# Altium schematic sheet Inverter-LLC Control.SchDoc
size A3
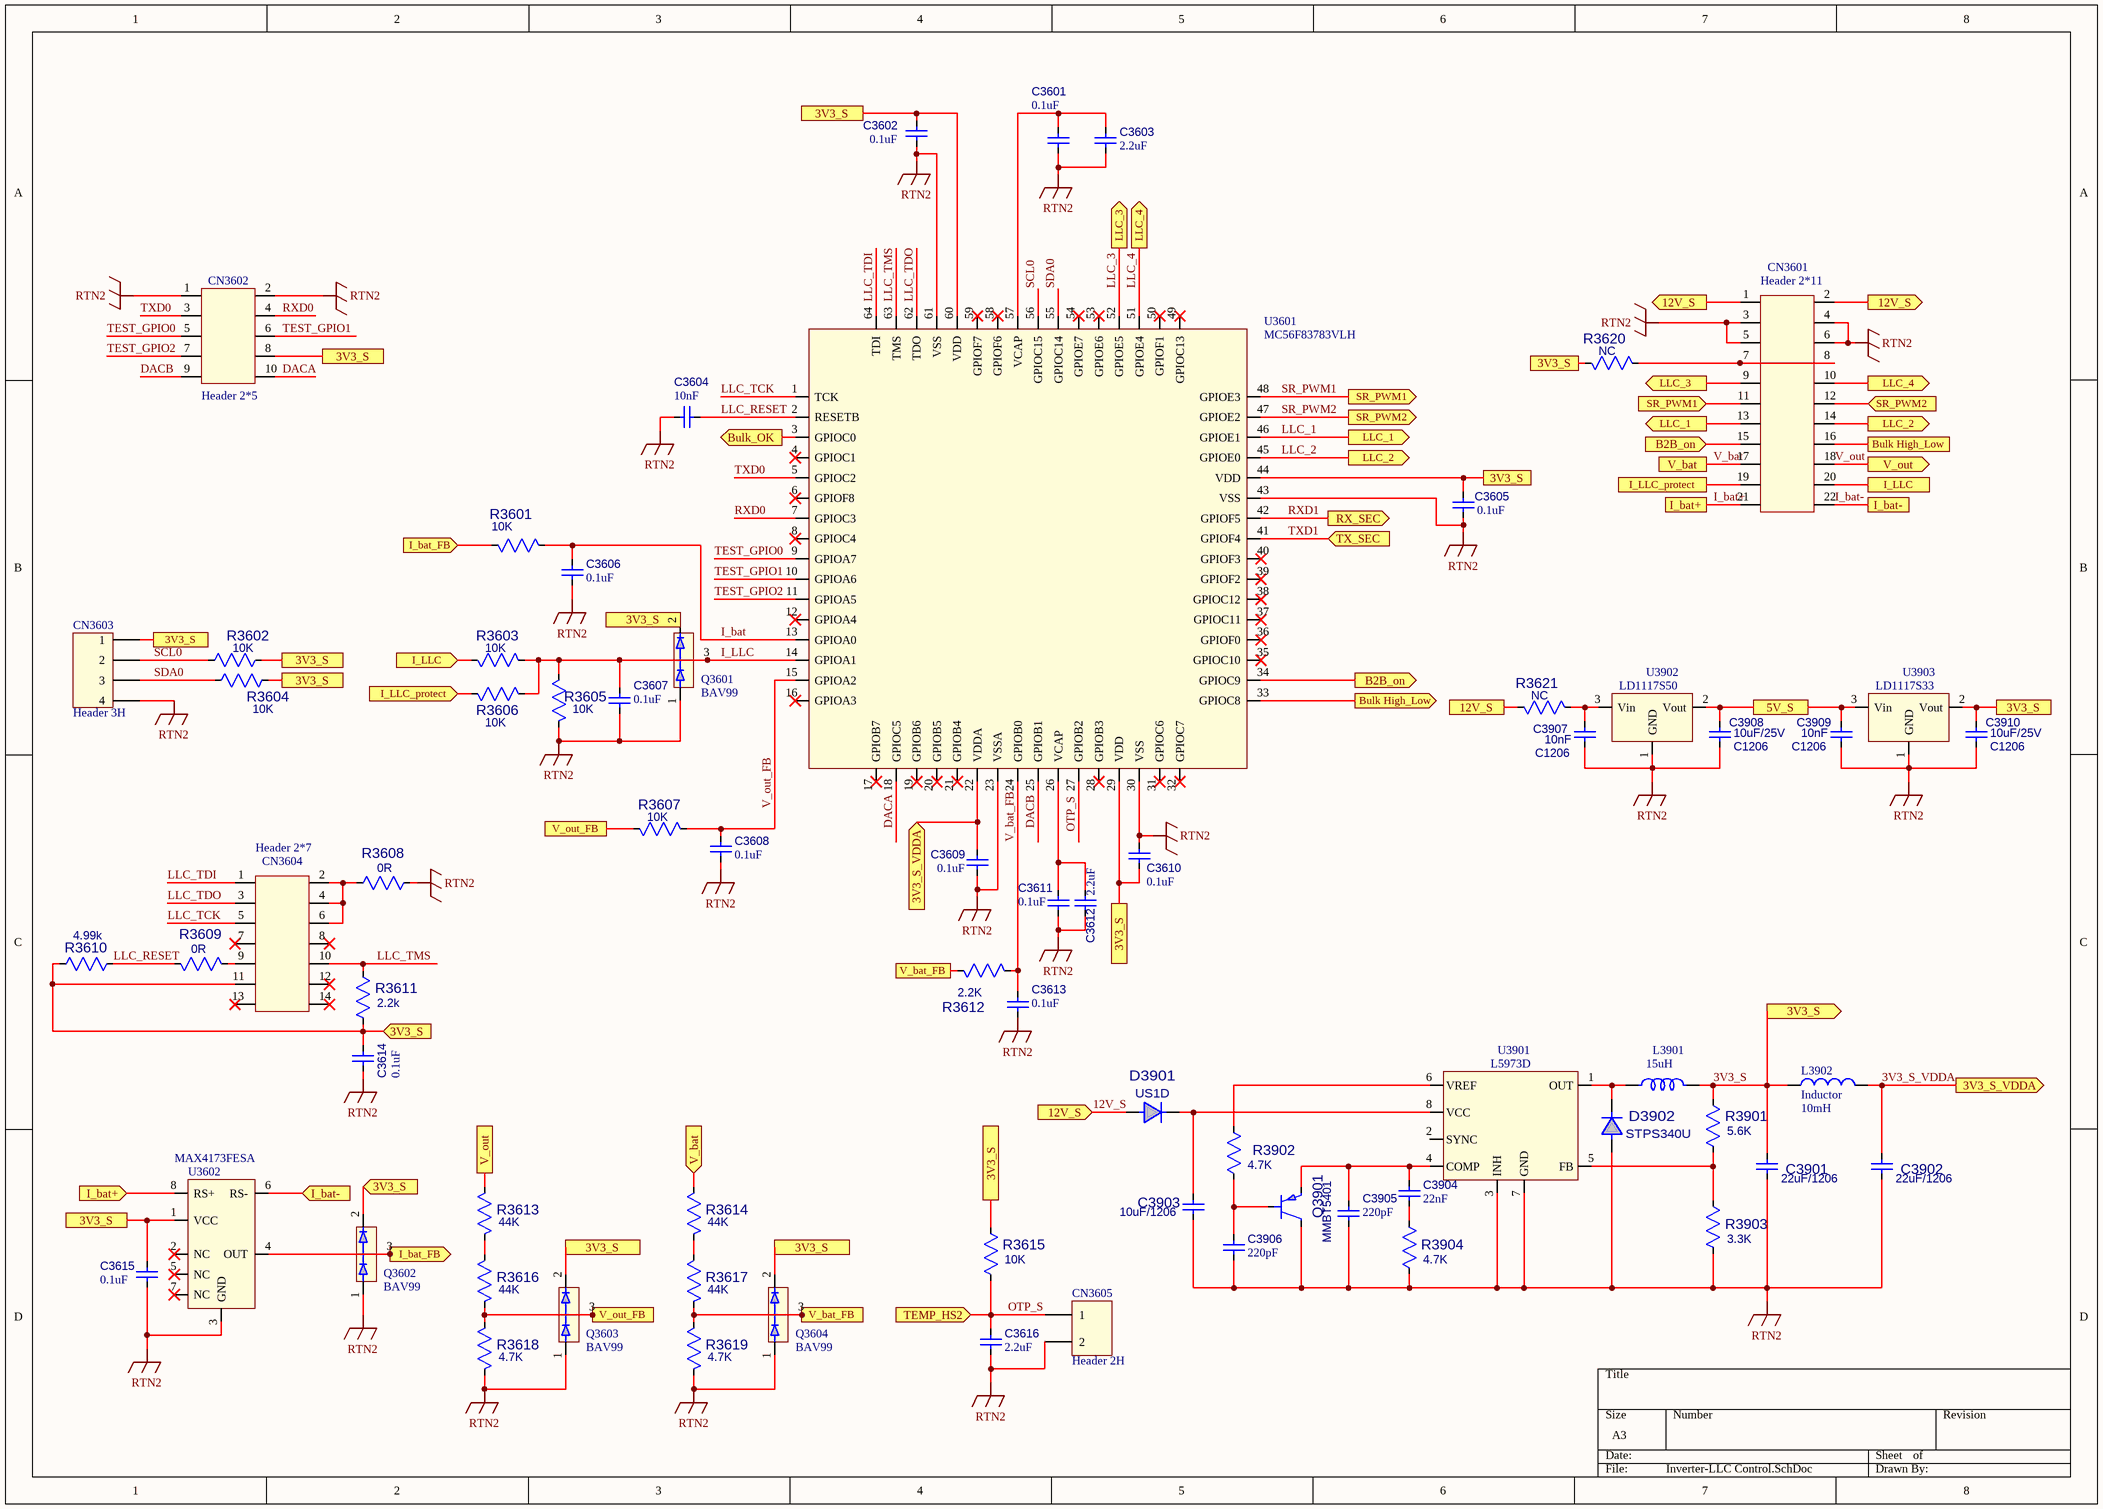
[diagram p0: Inverter-LLC Control.SchDoc]

## Parts
C3601  0.1uF  [C0603L]
C3602  0.1uF  [C0603L]
C3603  2.2uF  [C0603L]
C3604  10nF  [C0603L]
C3605  0.1uF  [C0603L]
C3606  0.1uF  [C0603L]
C3607  0.1uF  [C0603L]
C3608  0.1uF  [C0603L]
C3609  0.1uF  [C0603L]
C3610  0.1uF  [C0603L]
C3611  0.1uF  [C0603L]
C3612  2.2uF  [C0603L]
C3613  0.1uF  [C0603L]
C3614  0.1uF  [C0603L]
C3615  0.1uF  [C0603L]
C3616  2.2uF  [C0603L]
C3901  22uF/1206  [C1206]
C3902  22uF/1206  [C1206]
C3903  10uF/1206  [C1206]
C3904  22nF  [C0603L]
C3905  220pF  [C0603L]
C3906  220pF  [C0603L]
C3907  10nF  [C1206]
C3908  10uF/25V  [C1206]
C3909  10nF  [C1206]
C3910  10uF/25V  [C1206]
CN3601  Header 2*11  [HDR2X11h]
CN3602  Header 2*5  [HDR2X5]
CN3603  Header 3H  [HDR1X4]
CN3604  Header 2*7  [HDR2X7]
CN3605  Header 2H  [HDR1X2H]
D3901  US1D  [SMA]
D3902  STPS340U  [SMB]
L3901  15uH  [L-6*6]
L3902  Inductor  value 10mH  [R0603L]
Q3601  BAV99  [SOT23]
Q3602  BAV99  [SOT23]
Q3603  BAV99  [SOT23]
Q3604  BAV99  [SOT23]
Q3901  MMBT5401  [SOT23]
R3601  10K  [R0603L]
R3602  10K  [R0603L]
R3603  10K  [R0603L]
R3604  10K  [R0603L]
R3605  10K  [R0603L]
R3606  10K  [R0603L]
R3607  10K  [R0603L]
R3608  0R  [R0603L]
R3609  0R  [R0603L]
R3610  4.99k  [R0603L]
R3611  2.2k  [R0603L]
R3612  2.2K  [R0603L]
R3613  44K  [R0603L]
R3614  44K  [R0603L]
R3615  10K  [R0603L]
R3616  44K  [R0603L]
R3617  44K  [R0603L]
R3618  4.7K  [R0603L]
R3619  4.7K  [R0603L]
R3620  NC  [R0603L]
R3621  NC  [R0603L]
R3901  5.6K  [R0603L]
R3902  4.7K  [R0603L]
R3903  3.3K  [R0603L]
R3904  4.7K  [R0603L]
U3601  MC56F83783VLH  [LQFP-64]
U3602  MAX4173FESA  [SO8]
U3901  L5973D  [HSOP8]
U3902  LD1117S50  [SOT223]
U3903  LD1117S33  [SOT223]

## Ports
3V3_S, 3V3_S (in), 3V3_S (out), 3V3_S_VDDA (in), 3V3_S_VDDA (out), 5V_S, 12V_S, 12V_S (in), 12V_S (out), B2B_on (in), B2B_on (out), Bulk High_Low, Bulk High_Low (out), Bulk_OK (out), I_bat+, I_bat+ (in), I_bat-, I_bat- (in), I_bat_FB (in), I_bat_FB (out), I_LLC, I_LLC (in), I_LLC_protect, I_LLC_protect (in), LLC_1 (out), LLC_2 (out), LLC_3 (out), LLC_4 (out), RX_SEC (out), SR_PWM1 (in), SR_PWM1 (out), SR_PWM2 (in), SR_PWM2 (out), TEMP_HS2 (in), TX_SEC (in), V_bat, V_bat (in), V_bat_FB, V_out, V_out (out), V_out_FB

## Nets
RTN2: C3601.2 C3602.2 C3603.2 C3604.1 C3605.2 C3606.2 C3607.2 C3608.2 C3609.2 C3610.1 C3611.2 C3612.2 C3613.2 C3614.1 C3615.2 C3616.1 C3901.2 C3902.2 C3903.2 C3905.2 C3906.2 C3907.2 C3908.2 C3909.2 C3910.2 CN3601.3 CN3601.4 CN3601.5 CN3601.6 CN3602.1 CN3602.2 CN3603.4 CN3605.2 D3902.A Q3601.1 Q3602.1 Q3603.1 Q3604.1 Q3901.3(C) R3605.1 R3608.2 R3618.1 R3619.1 R3903.1 R3904.1 U3601.23(VSSA) U3601.30(VSS) U3601.43(VSS) U3601.61(VSS) U3602.3(GND) U3901.3(INH) U3901.7(GND) U3902.1(GND) U3903.1(GND)
3V3_S: C3602.1 C3605.1 C3610.2 C3614.2 C3615.1 C3901.1 C3910.1 CN3602.8 CN3603.1 CN3604.11 L3901.2 L3902.1 Q3601.2 Q3602.2 Q3603.2 Q3604.2 R3602.2 R3604.2 R3610.2 R3611.2 R3615.1 R3620.2 R3901.2 U3601.29(VDD) U3601.44(VDD) U3601.60(VDD) U3602.1(VCC) U3903.2(Vout) ; port 3V3_S
3V3_S_VDDA: C3609.1 C3902.1 L3902.2 U3601.22(VDDA) ; port 3V3_S_VDDA
5V_S: C3908.1 C3909.1 U3902.2(Vout) U3903.3(Vin) ; port 5V_S
12V_S: CN3601.1 CN3601.2 D3901.A R3621.2 ; port 12V_S
B2B_on: CN3601.15 U3601.34(GPIOC9) ; port B2B_on
Bulk High_Low: CN3601.16 U3601.33(GPIOC8) ; port Bulk High_Low
Bulk_OK: U3601.3(GPIOC0) ; port Bulk_OK
DACA: CN3602.10 U3601.18(GPIOC5)
DACB: CN3602.9 U3601.25(GPIOB1)
I_bat: C3606.1 R3601.1 U3601.13(GPIOA0)
I_bat+: CN3601.21 U3602.8(RS+) ; port I_bat+
I_bat-: CN3601.22 U3602.6(RS-) ; port I_bat-
I_bat_FB: Q3602.3 R3601.2 U3602.4(OUT) ; port I_bat_FB
I_LLC: C3607.1 Q3601.3 R3603.1 R3605.2 R3606.1 U3601.14(GPIOA1)
I_LLC: CN3601.20 R3603.2 ; port I_LLC  [a separate net that carries the same name]
I_LLC_protect: CN3601.19 R3606.2 ; port I_LLC_protect
LLC_1: CN3601.13 U3601.46(GPIOE1) ; port LLC_1
LLC_2: CN3601.14 U3601.45(GPIOE0) ; port LLC_2
LLC_3: CN3601.9 U3601.52(GPIOE5) ; port LLC_3
LLC_4: CN3601.10 U3601.51(GPIOE4) ; port LLC_4
LLC_RESET: C3604.2 R3609.2 R3610.1 U3601.2(RESETB)
LLC_TCK: CN3604.5 U3601.1(TCK)
LLC_TDI: CN3604.1 U3601.64(TDI)
LLC_TDO: CN3604.3 U3601.62(TDO)
LLC_TMS: CN3604.10 R3611.1 U3601.63(TMS)
OTP_S: C3616.2 CN3605.1 R3615.2 U3601.27(GPIOB2) ; port TEMP_HS2
RXD0: CN3602.4 U3601.7(GPIOC3)
RXD1: U3601.42(GPIOF5) ; port RX_SEC
SCL0: CN3603.2 R3602.1 U3601.56(GPIOC15)
SDA0: CN3603.3 R3604.1 U3601.55(GPIOC14)
SR_PWM1: CN3601.11 U3601.48(GPIOE3) ; port SR_PWM1
SR_PWM2: CN3601.12 U3601.47(GPIOE2) ; port SR_PWM2
TEST_GPIO0: CN3602.5 U3601.9(GPIOA7)
TEST_GPIO1: CN3602.6 U3601.10(GPIOA6)
TEST_GPIO2: CN3602.7 U3601.11(GPIOA5)
TXD0: CN3602.3 U3601.5(GPIOC2)
TXD1: U3601.41(GPIOF4) ; port TX_SEC
V_bat: CN3601.17 R3614.2 ; port V_bat
V_bat_FB: C3613.1 R3612.1 U3601.24(GPIOB0)
V_bat_FB: Q3604.3 R3612.2 R3617.1 R3619.2 ; port V_bat_FB  [a separate net that carries the same name]
V_out: CN3601.18 R3613.2 ; port V_out
V_out_FB: C3608.1 R3607.1 U3601.15(GPIOA2)
V_out_FB: Q3603.3 R3607.2 R3616.1 R3618.2 ; port V_out_FB  [a separate net that carries the same name]
NetC3601_1: C3601.1 C3603.1 U3601.57(VCAP)
NetC3611_1: C3611.1 C3612.1 U3601.26(VCAP)
NetC3903_1: C3903.1 D3901.K U3901.8(VCC)
NetC3904_1: C3904.1 C3905.1 Q3901.2(E) U3901.4(COMP)
NetC3904_2: C3904.2 R3904.2
NetC3906_1: C3906.1 Q3901.1(B) R3902.1
NetC3907_1: C3907.1 R3621.1 U3902.3(Vin)
NetCN3601_7: CN3601.7 CN3601.8 R3620.1
NetCN3604_2: CN3604.2 CN3604.4 CN3604.6 R3608.1
NetCN3604_9: CN3604.9 R3609.1
NetD3902_K: D3902.K L3901.1 U3901.1(OUT)
NetR3613_1: R3613.1 R3616.2
NetR3614_1: R3614.1 R3617.2
NetR3901_1: R3901.1 R3903.2 U3901.5(FB)
NetR3902_2: R3902.2 U3901.6(VREF)

Not connected (* = marked no-connect by the designer): CN3604 7* 8* 12* 13* 14*; U3601 4(GPIOC1)* 6(GPIOF8)* 8(GPIOC4)* 12(GPIOA4)* 16(GPIOA3)* 17(GPIOB7)* 19(GPIOB6)* 20(GPIOB5)* 21(GPIOB4)* 28(GPIOB3)* 31(GPIOC6)* 32(GPIOC7)* 35(GPIOC10)* 36(GPIOF0)* 37(GPIOC11)* 38(GPIOC12)* 39(GPIOF2)* 40(GPIOF3)* 49(GPIOC13)* 50(GPIOF1)* 53(GPIOE6)* 54(GPIOE7)* 58(GPIOF6)* 59(GPIOF7)*; U3602 2(NC)* 5(NC)* 7(NC)*; U3901 2(SYNC)

## Library data of the parts
C3601-C3616 C3904-C3906 = C0603: package: C0603; OPEN: OPEN
C3901-C3903 C3907-C3910 = C1206: package: C1206
CN3601 = Header 2*11: PCB Footprint: CONP10
CN3602 = Header 2*5: PCB Footprint: CONP10
CN3603 = Header 4H: Header, 4-Pin; LatestRevisionDate: 17-Jul-2002; LatestRevisionNote: Re-released for DXP Platform.; Publisher: Altium Limited
CN3604 = Header 2*7: PCB Footprint: CONP10
CN3605 = Header 2H: Header, 2 Pin, Right Angle; LatestRevisionDate: 17-Jul-2002; LatestRevisionNote: Re-released for DXP Platform.; Publisher: Altium Limited
D3901 D3902 = Diode: ALL FOOTPRINT; package: SOD123
L3901 = L: Vendor: SHUNYUE; name: Inductor; miao: 150uH,※I§倰ㄛT6*10,耳=0.5*1
L3902 = Inductor: Code_IEC: 1005; Published: 8-Jun-2000; LatestRevisionDate: 29-May-2009; LatestRevisionNote: IPC-7351 Footprint Added.; PackageReference: 0402-A; Publisher: Altium Limited; PackageDescription: Chip Inductor; Code_JEITA: 0402
Q3901 = PNP: SOT-23-PNP; package: SOT-23
R3601-R3621 R3901-R3904 = R0603: package: R0603
U3601 = MC56F83783VLH: STM32G474; Vender: *
U3602 = MAX4173FESA: LM358
U3902 U3903 = LD1117: Partnumber: *; Vender: *